# EAGLE design lm358-3ops-ia (EAGLE 5.07)
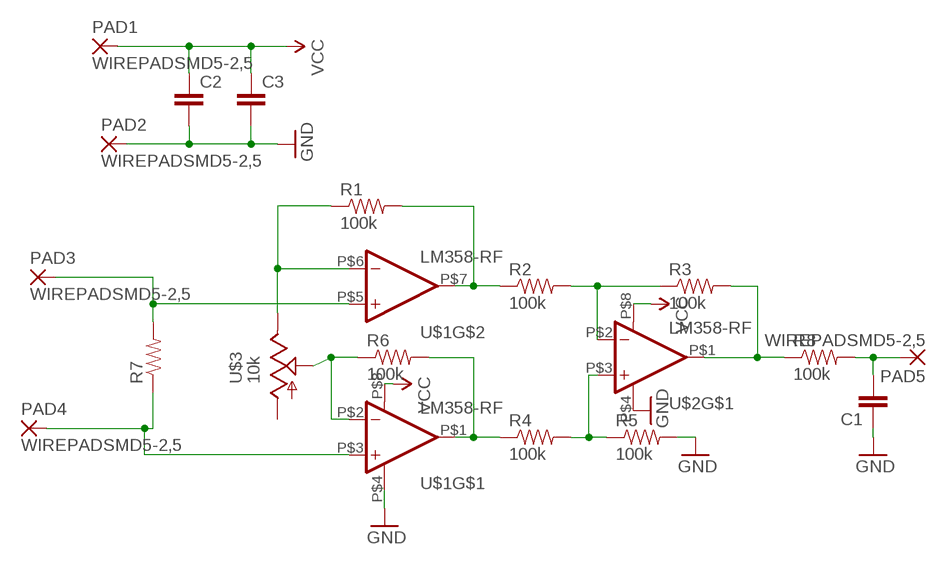
[diagram p0: schematic, sheet 1]

## Parts
C1  CAP-RF  [CAP-SMD-SMALL]
C2  CAP-RF  [CAP-SMD-SMALL]
C3  CAP-RF  [CAP-SMD-SMALL]
PAD1  WIREPADSMD5-2,5  [5-2,5]
PAD2  WIREPADSMD5-2,5  [5-2,5]
PAD3  WIREPADSMD5-2,5  [5-2,5]
PAD4  WIREPADSMD5-2,5  [5-2,5]
PAD5  WIREPADSMD5-2,5  [5-2,5]
R1  100k  RESISTOR1/4W-RF  [AXIAL-0.3-SMD]
R2  100k  RESISTOR1/4W-RF  [AXIAL-0.3-SMD]
R3  100k  RESISTOR1/4W-RF  [AXIAL-0.3-SMD]
R4  100k  RESISTOR1/4W-RF  [AXIAL-0.3-SMD]
R5  100k  RESISTOR1/4W-RF  [AXIAL-0.3-SMD]
R6  100k  RESISTOR1/4W-RF  [AXIAL-0.3-SMD]
R7  RESISTOR1/4W-RF  [AXIAL-0.3-SMD]
R8  100k  RESISTOR1/4W-RF  [AXIAL-0.3-SMD]
U$1  LM358-RF  [DIP8-RF]
U$2  LM358-RF  [DIP8-RF]
U$3  10k  POTB64Y-3296  [B64Y]

## Nets
GND: C1.P$1 C2.P$2 C3.P$2 PAD2.1(P) R5.P$2 U$1.P$4(V-) U$2.P$4(V-)
N$1: R6.P$1 U$1.P$2(-IN) U$3.S
N$2: R1.P$1 U$1.P$6(-IN) U$3.E
N$3: R1.P$2 R2.P$1 U$1.P$7(OUT)
N$4: R2.P$2 R3.P$1 U$2.P$2(-IN)
N$5: R4.P$1 R6.P$2 U$1.P$1(OUT)
N$6: R4.P$2 R5.P$1 U$2.P$3(+IN)
N$7: PAD3.1(P) R7.P$2 U$1.P$5(+IN)
N$8: PAD4.1(P) R7.P$1 U$1.P$3(+IN)
N$9: C1.P$2 PAD5.1(P) R8.P$2
N$10: R3.P$2 R8.P$1 U$2.P$1(OUT)
VCC: C2.P$1 C3.P$1 PAD1.1(P) U$1.P$8(V+) U$2.P$8(V+)
Unconnected: U$2.P$5(+IN) U$2.P$6(-IN) U$2.P$7(OUT) U$3.A

## Library data of the parts
C1-C3 = digital-toy:CAP: Capacitor Standard 0603 ceramic capacitor, and 0.1" leaded capacitor.
PAD1-PAD5 = wirepad:WIREPAD: Wire PAD connect wire on PCB
R1-R8 = digital-toy:RESISTOR: Resistor Basic schematic elements and footprints for 0603, 1206, and PTH 1/10th watt (small) resistors. digital-toy copy vertical mount of axial-0.3 from rcl.lbr : the 0207/xx
U$1 U$2 = digital-toy:LM358
U$3 = digital-toy:POT: POT digital toy POT, 3296 multi turn, blue-white ... hyl 8/07/2001

## Board
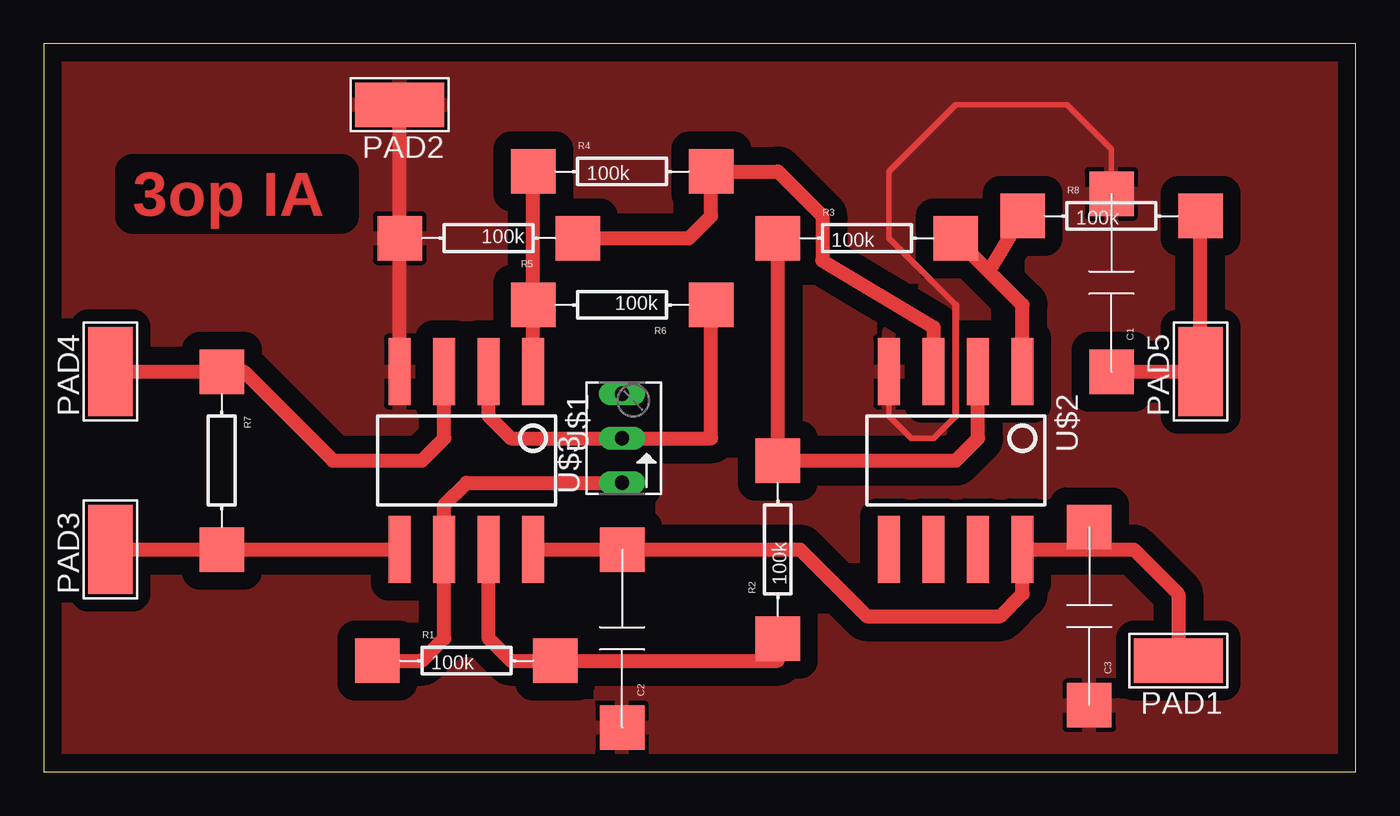
[diagram p1: board, top side]

Size 74.91 x 41.58 mm. Coordinates in mm from the lower left corner, seen from the top.
Outline: 0,0 74.91,0 74.91,41.58 0,41.58 0,0
Copper layers (1*16): Top 0.035mm / dielectric 1.5mm / Bottom 0.035mm
Design rules "default": minimum track width 10mil, minimum drill 24mil, track to track 8mil, track to pad 8mil, pad to pad 8mil, via to via 8mil, smd to smd 8mil, copper to edge 40mil, drill to drill 8mil, minimum pad ring 10mil, minimum via ring 8mil, stop-mask expansion 4mil, vias tented up to drill 0mil, thermal gap 10mil

### Footprints (pad centres in the part's own frame; a part is rotated, then mirrored left to right if it is on the bottom)
CAP-SMD-SMALL = smd 2.54 x 2.54: P$1 5.08,0; P$2 -5.08,0
5-2,5 = smd 2.54 x 5.08: 1 0,0
AXIAL-0.3-SMD = smd 2.54 x 2.54: P$1 -5.08,0; P$2 5.08,0
DIP8-RF = smd 1.27 x 3.81: P$1 0,-3.81; P$2 2.54,-3.81; P$3 5.08,-3.81; P$4 7.62,-3.81; P$5 7.62,6.35; P$6 5.08,6.35; P$7 2.54,6.35; P$8 0,6.35
B64Y = drill 0.813 long: A 2.54,0; E -2.54,0; S 0,0

### Placement (x,y rotation side)
C1  60.96,27.94 90 top
C2  33.02,7.62 90 top
C3  59.69,8.89 90 top
PAD1  64.77,6.35 90 top
PAD2  20.32,38.1 90 top
PAD3  3.81,12.7 0 top
PAD4  3.81,22.86 0 top
PAD5  66.04,22.86 0 top
R1  24.13,6.35 0 top
R2  41.91,12.7 90 top
R3  46.99,30.48 0 top
R4  33.02,34.29 0 top
R5  25.4,30.48 180 top
R6  33.02,26.67 180 top
R7  10.16,17.78 270 top
R8  60.96,31.75 0 top
U$1  27.94,19.05 180 top
U$2  55.88,19.05 180 top
U$3  33.02,19.05 90 top

### Tracks (layer width: path | path; a pad name or v marks a point on that pad's centre or on a via)
GND
  Top 0.305: U$2.P$4 48.26,20.32 49.53,19.05 50.8,19.05 52.07,20.32 | 52.07,26.67 48.26,30.48 48.26,34.29 52.07,38.1 58.42,38.1 60.96,35.56 C1.P$1
  Top 0.406: 52.07,20.32 52.07,26.67
  Top 0.813: U$1.P$4 R5.P$2 PAD2.1
  pour Top (isolate 1.016): -3.81,48.26 74.93,48.26 86.36,36.83 86.36,3.81 72.39,-10.16 1.27,-10.16 -8.89,0 -8.89,43.18
N$1
  Top 0.813: U$1.P$2 25.4,20.32 26.67,19.05 U$3.S 38.1,19.05 R6.P$1
N$2
  Top 0.813: R1.P$1 21.59,6.35 22.86,7.62 U$1.P$6 22.86,15.24 24.13,16.51 U$3.E
N$3
  Top 0.813: U$1.P$7 25.4,7.62 26.67,6.35 R1.P$2 41.91,6.35 R2.P$1
N$4
  Top 0.813: R3.P$1 R2.P$2 52.07,17.78 53.34,19.05 U$2.P$2
N$5
  Top 0.813: U$1.P$1 R6.P$2 R4.P$1
N$6
  Top 0.813: R5.P$1 36.83,30.48 38.1,31.75 R4.P$2 41.91,34.29 44.45,31.75 44.45,29.21 50.8,25.4 U$2.P$3
N$7
  Top 0.813: PAD3.1 R7.P$2 U$1.P$5
N$8
  Top 0.813: PAD4.1 R7.P$1 11.43,22.86 16.51,17.78 21.59,17.78 22.86,19.05 U$1.P$3
N$9
  Top 0.813: R8.P$2 PAD5.1 C1.P$2
N$10
  Top 0.813: 53.98,28.57 55.88,26.67 U$2.P$1 | 53.98,28.57 R3.P$2 | 53.98,28.57 R8.P$1
VCC
  Top 0.813: 59.69,12.7 U$2.P$8 55.88,10.16 54.61,8.89 46.99,8.89 43.18,12.7 C2.P$1 U$1.P$8 | 59.69,12.7 62.23,12.7 64.77,10.16 PAD1.1 | 59.69,12.7 C3.P$1

### Text on the board
Top: 3op IA